# EAGLE design scheme_with_poly (EAGLE 5.11)
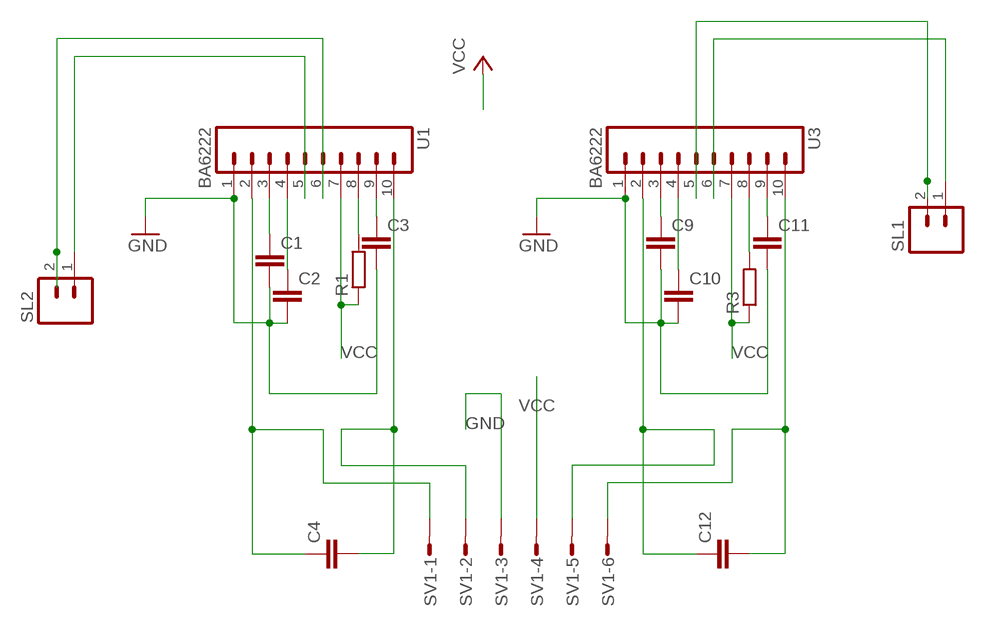
[diagram p0: schematic, sheet 1]

## Parts
C1  C5/2.5  [C5B2.5]
C2  C5/2.5  [C5B2.5]
C3  C5/2.5  [C5B2.5]
C4  C5/2.5  [C5B2.5]
C9  C5/2.5  [C5B2.5]
C10  C5/2.5  [C5B2.5]
C11  C5/2.5  [C5B2.5]
C12  C5/2.5  [C5B2.5]
R1  R-EU_0207/15  [0207/15]
R3  R-EU_0207/15  [0207/15]
SL1  M02  [02P]
SL2  M02  [02P]
SV1  MT6-6  [MT6-6]
U1  BA6222  M10  [10P]
U3  BA6222  M10  [10P]

## Nets
GND: C1.2 C2.2 C3.2 C9.2 C10.2 C11.2 SV1.3 U1.1 U3.1
N$1: C1.1 U1.3
N$2: C2.1 U1.4
N$3: C3.1 U1.9
N$4: R1.2 U1.8
N$5: C9.1 U3.3
N$6: C4.1 SV1.1 U1.2
N$7: C4.2 SV1.2 U1.10
N$8: C10.1 U3.4
N$9: C11.1 U3.9
N$10: R3.2 U3.8
N$11: C12.1 SV1.5 U3.2
N$12: C12.2 SV1.6 U3.10
N$13: SL2.1 U1.5
N$14: SL2.2 U1.6
N$15: SL1.2 U3.5
N$16: SL1.1 U3.6
VCC: R1.1 R3.1 SV1.4 U1.7 U3.7

## Library data of the parts
C1-C4 C9-C12 = capacitor-wima:C: CAPACITOR naming: grid - package width
R1 R3 = rcl:R-EU_: RESISTOR, European symbol
SL1 SL2 = con-amp-quick:M02: AMP QUICK CONNECTOR; OC_FARNELL: unknown; OC_NEWARK: unknown
SV1 = con-amp-mt:MT6-6: AMP MT6 CONNECTOR; OC_FARNELL: unknown; OC_NEWARK: unknown
U1 U3 = con-amp-quick:M10: AMP QUICK CONNECTOR; OC_FARNELL: unknown; OC_NEWARK: unknown

## Board
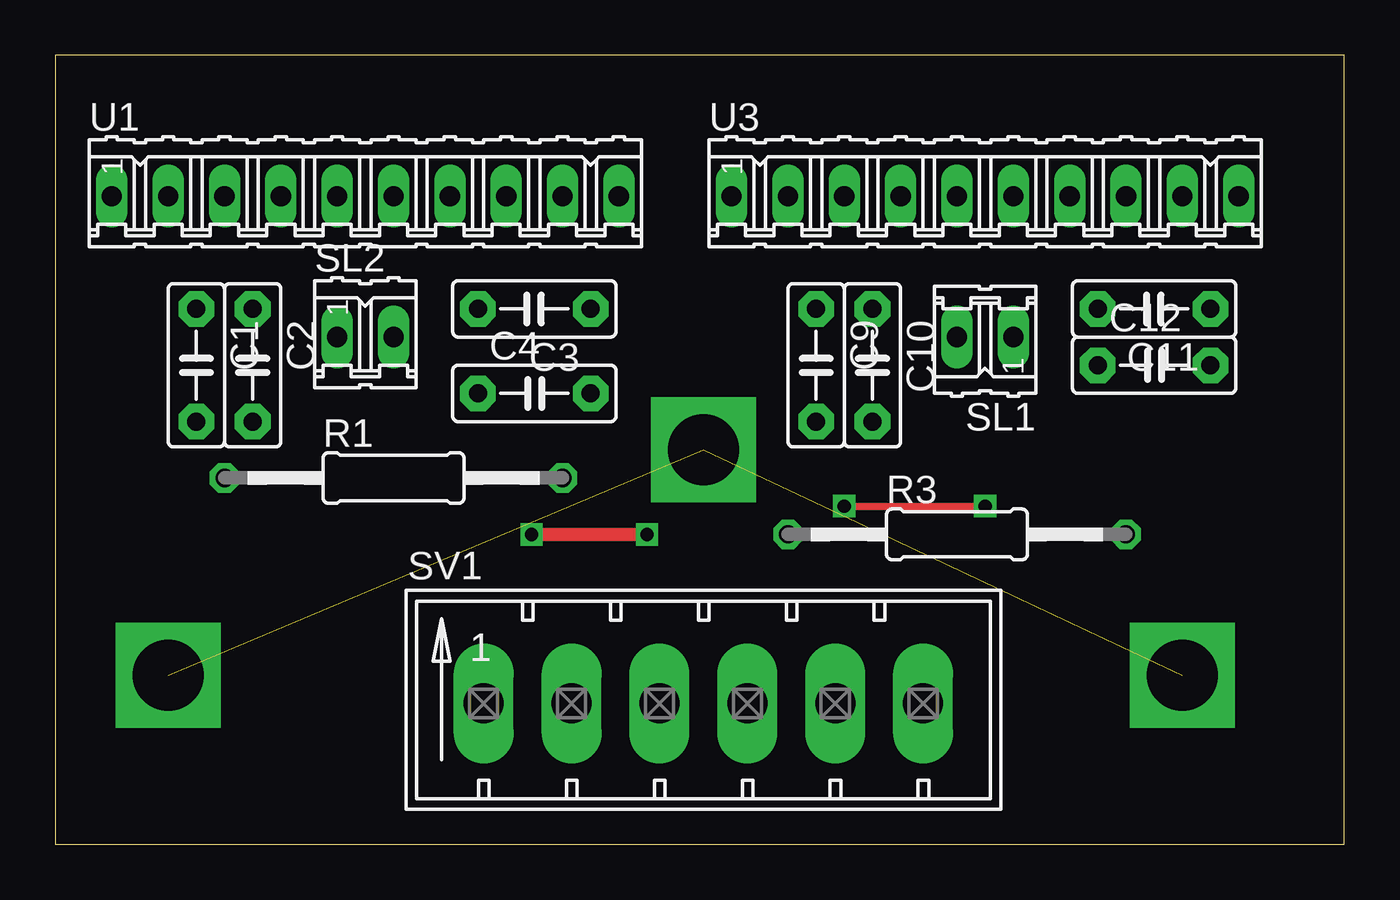
[diagram p1: board, top side]
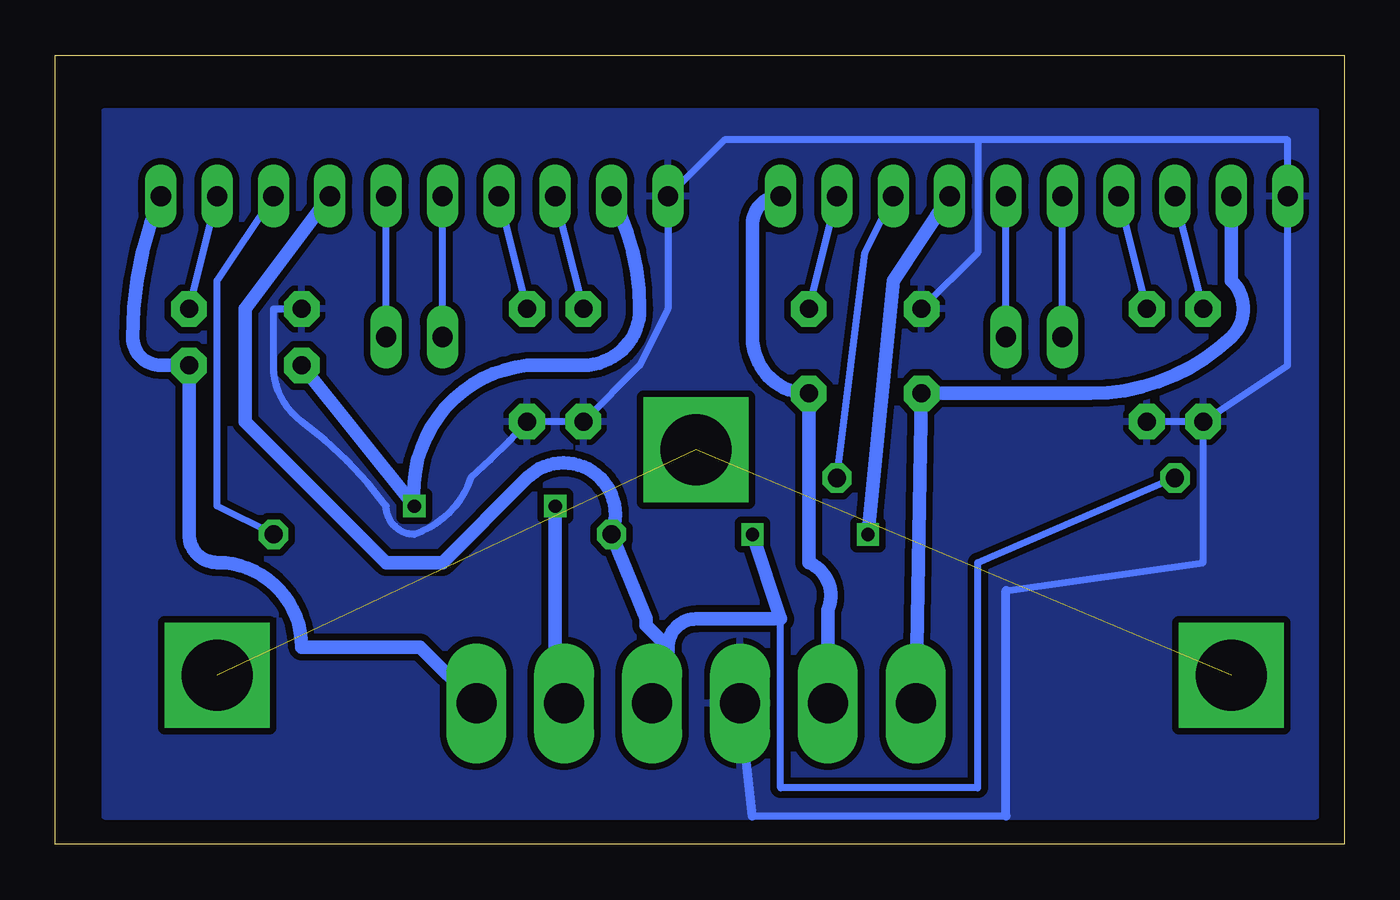
[diagram p2: board, bottom side, seen from below]

Size 58.09 x 35.55 mm. Coordinates in mm from the lower left corner, seen from the top.
Outline: 0,0 58.09,0 58.09,35.55 0,35.55 0,0
Copper layers (1*16): Top 0.035mm / dielectric 1.5mm / Bottom 0.035mm
Design rules "default *": minimum track width 14mil, minimum drill 32mil, track to track 12mil, track to pad 12mil, pad to pad 12mil, via to via 12mil, smd to smd 8mil, copper to edge 40mil, drill to drill 40mil, minimum pad ring 10mil, minimum via ring 8mil, stop-mask expansion 4mil, vias tented up to drill 0mil, thermal gap 10mil

### Footprints (pad centres in the part's own frame; a part is rotated, then mirrored left to right if it is on the bottom)
C5B2.5 = drill 0.813 pad 1.6 octagon: 1 -2.54,0; 2 2.54,0
0207/15 = drill 0.813 octagon: 1 -7.62,0; 2 7.62,0
02P = drill 0.914 long: 1 -1.27,0; 2 1.27,0
MT6-6 = drill 1.803 long: 1 -9.906,0; 2 -5.944,0; 3 -1.981,0; 4 1.981,0; 5 5.944,0; 6 9.906,0
10P = drill 0.914 long: 1 -11.43,0; 2 -8.89,0; 3 -6.35,0; 4 -3.81,0; 5 -1.27,0; 6 1.27,0; 7 3.81,0; 8 6.35,0; 9 8.89,0; 10 11.43,0

### Placement (x,y rotation side)
C1  6.35,21.59 270 top
C2  8.89,21.59 270 top
C3  21.59,24.13 180 top
C4  21.59,20.32 0 top
C9  34.29,21.59 270 top
C10  36.83,21.59 270 top
C11  49.53,24.13 180 top
C12  49.53,21.59 0 top
R1  15.24,16.51 0 top
R3  40.64,13.97 0 top
SL1  41.91,22.86 180 top
SL2  13.97,22.86 0 top
SV1  29.21,6.35 0 top
U1  13.97,29.21 0 top
U3  41.91,29.21 0 top

### Tracks (layer width: path | path; a pad name or v marks a point on that pad's centre or on a via)
GND
  Bottom 0.305: C11.2 48.26,24.13 48.26,21.59 arc-53 46.99,19.05 arc16 43.18,15.24 arc-90 41.91,13.97 arc-53 39.37,16.51 arc-6 C10.2 C9.2 31.75,21.59 30.48,24.13 U3.1 27.94,31.75 16.51,31.75 | C1.2 2.54,21.59 U1.1 2.54,31.75 16.51,31.75 | C1.2 C2.2 | 15.24,1.27 26.67,1.27 | 15.24,11.43 6.35,12.7 C1.2 | C3.2 16.51,26.67 16.51,31.75
  Bottom 0.406: 26.67,1.27 SV1.3 | 15.24,1.27 15.24,11.43
  pour Bottom: 1.27,31.75 1.27,33.02 55.88,33.02 55.88,1.27 1.27,1.27
N$1
  Bottom 0.305: C1.1 U1.3
N$2
  Bottom 0.305: C2.1 U1.4
N$3
  Bottom 0.305: C3.1 U1.9
N$4
  Bottom 0.305: R1.2 21.59,26.67 U1.8
N$5
  Bottom 0.305: C9.1 U3.3
N$6
  Bottom 0.61: SV1.1 C4.1 11.43,20.32 arc-44 5.08,22.86 arc-93 5.08,25.4 U1.2
N$7
  Bottom 0.61: SV1.2 23.27,10.57 arc-90 24.13,12.7 C4.2 arc90 26.67,22.86 26.67,27.94 arc90 U1.10
N$8
  Bottom 0.305: C10.1 U3.4
N$9
  Bottom 0.305: C11.1 U3.9
N$10
  Bottom 0.305: U3.8 50.8,25.4 50.8,15.24 R3.2
N$11  (via drill 0.6)
  Top 0.305: v35.56,15.24 v41.91,15.24
  Bottom 0.61: SV1.5 arc90 35.56,6.76 v35.56,15.24 | C12.1 v41.91,15.24 arc90 36.83,21.59 34.29,21.59 arc-90 31.75,24.13 arc-28 U3.2
N$12
  Bottom 0.61: SV1.6 41.66,8.89 46.99,8.89 arc-90 50.8,12.7 arc90 52.07,13.97 C12.2 53.34,21.59 arc90 54.61,22.86 arc23 U3.10
N$13
  Bottom 0.305: SL2.1 U1.5
N$14
  Bottom 0.305: SL2.2 U1.6
N$15
  Bottom 0.305: SL1.2 U3.5
N$16
  Bottom 0.305: SL1.1 U3.6
N$17  (via drill 3.2)  (2 unrouted)
  other vias: 5.08,7.62 29.21,17.78 50.8,7.62
VCC  (via drill 0.6)
  Top 0.61: v26.67,13.97 v21.46,13.96
  Bottom 0.305: R1.1 16.51,12.7 16.51,2.54 25.4,2.54 25.4,10.16
  Bottom 0.61: U1.7 20.32,25.4 v21.46,13.96 | v26.67,13.97 25.4,10.16 29.21,10.16 arc-90 30.48,8.89 | 30.48,8.89 31.47,9.88 31.47,10.18 R3.1 arc-157 36.83,16.51 40.64,12.7 43.18,12.7 49.53,19.05 49.53,24.13 U3.7 | 30.48,8.89 30.48,7.06 SV1.4